# EAGLE design Indev 2 DSP (EAGLE 6.3)
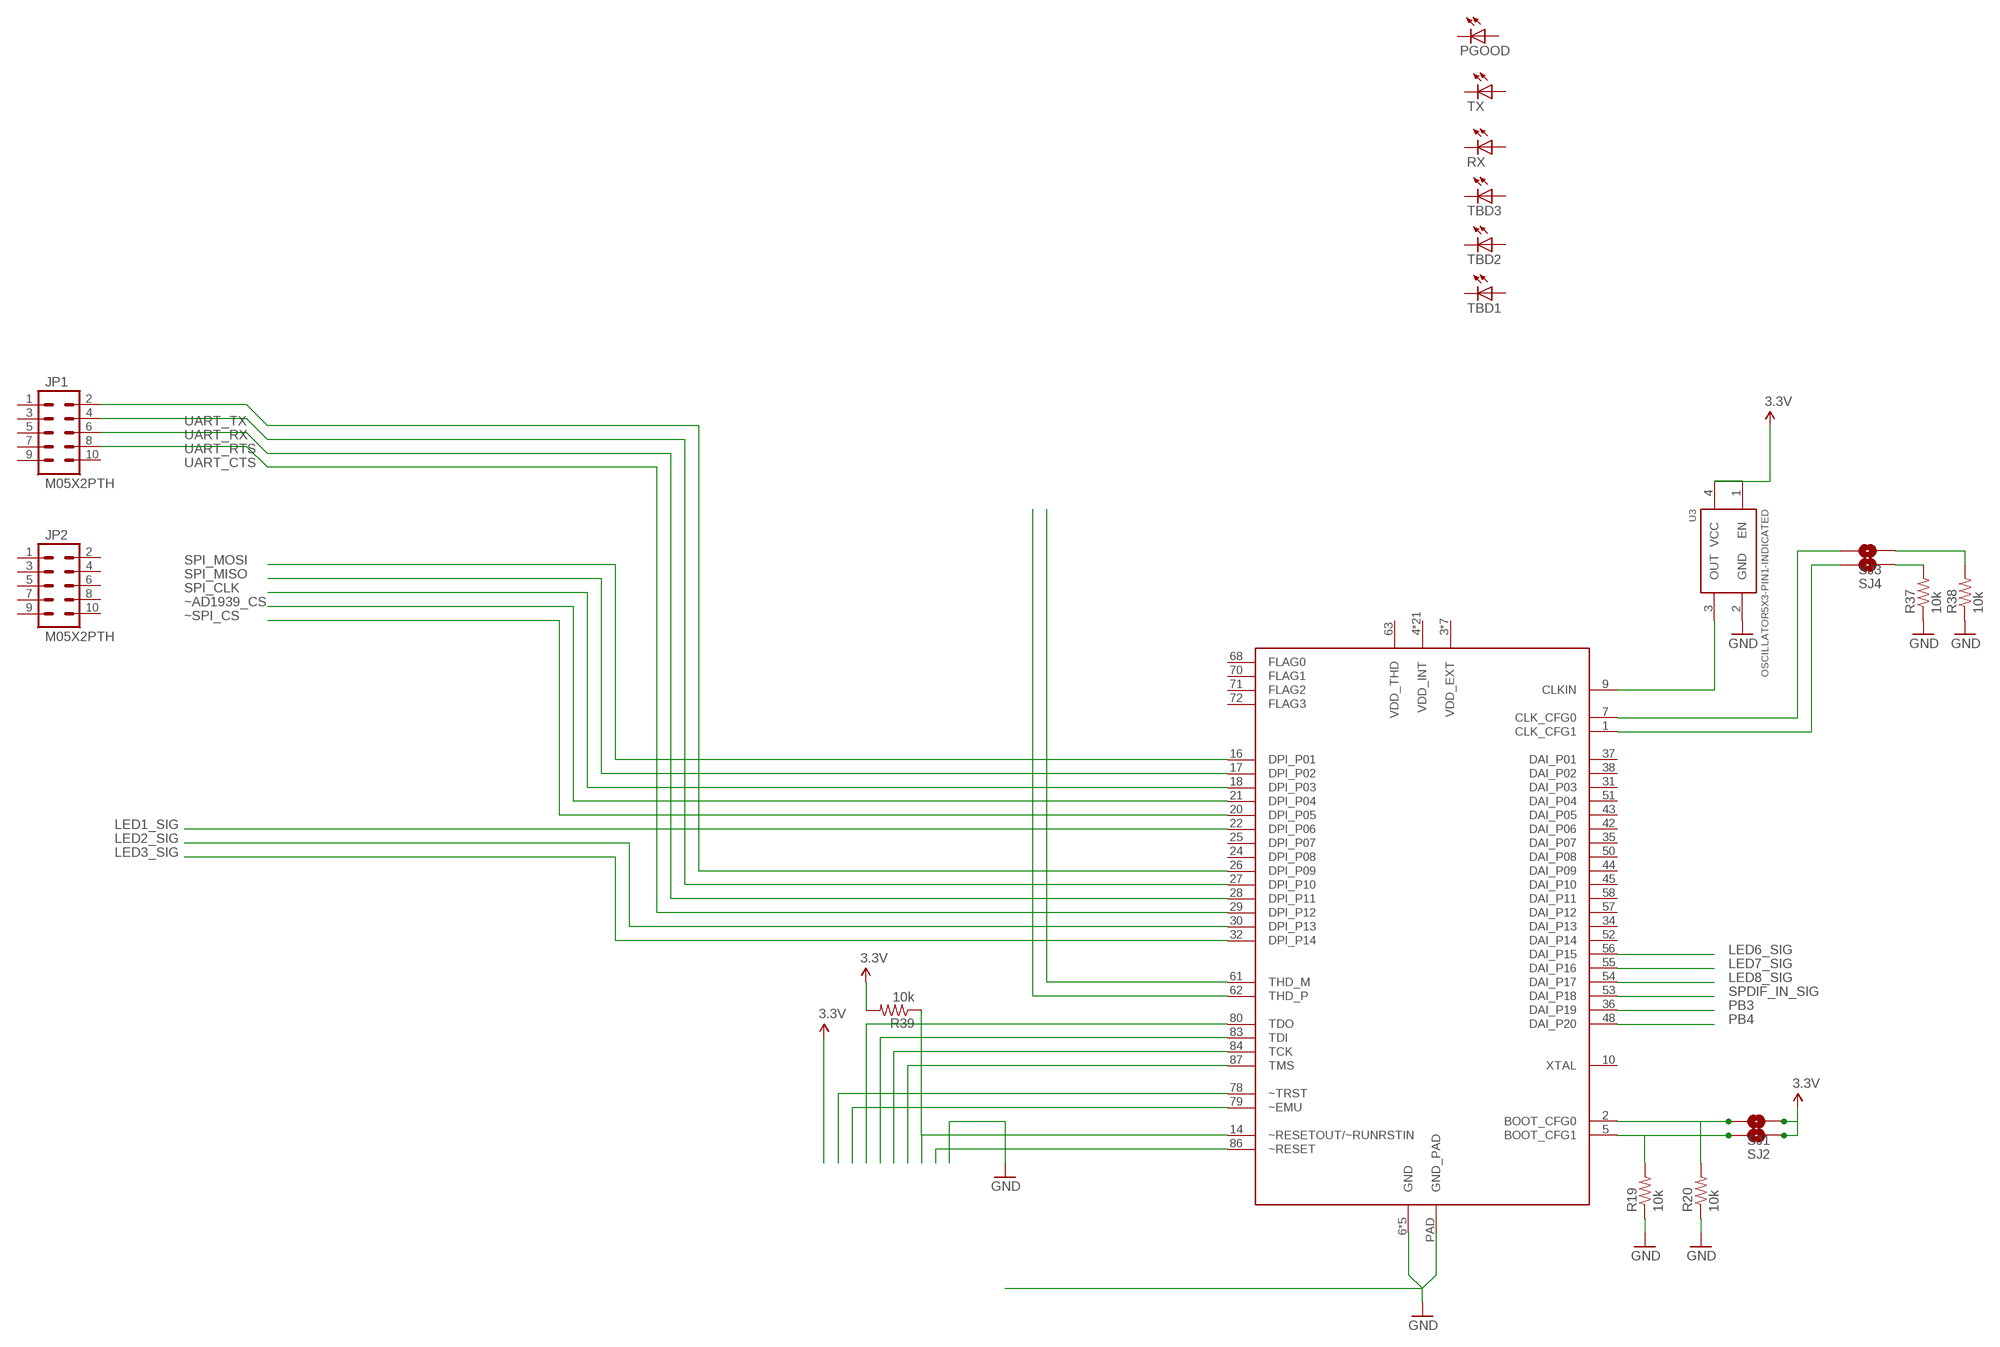
[diagram p0: schematic, sheet 1, part 1 of 2]
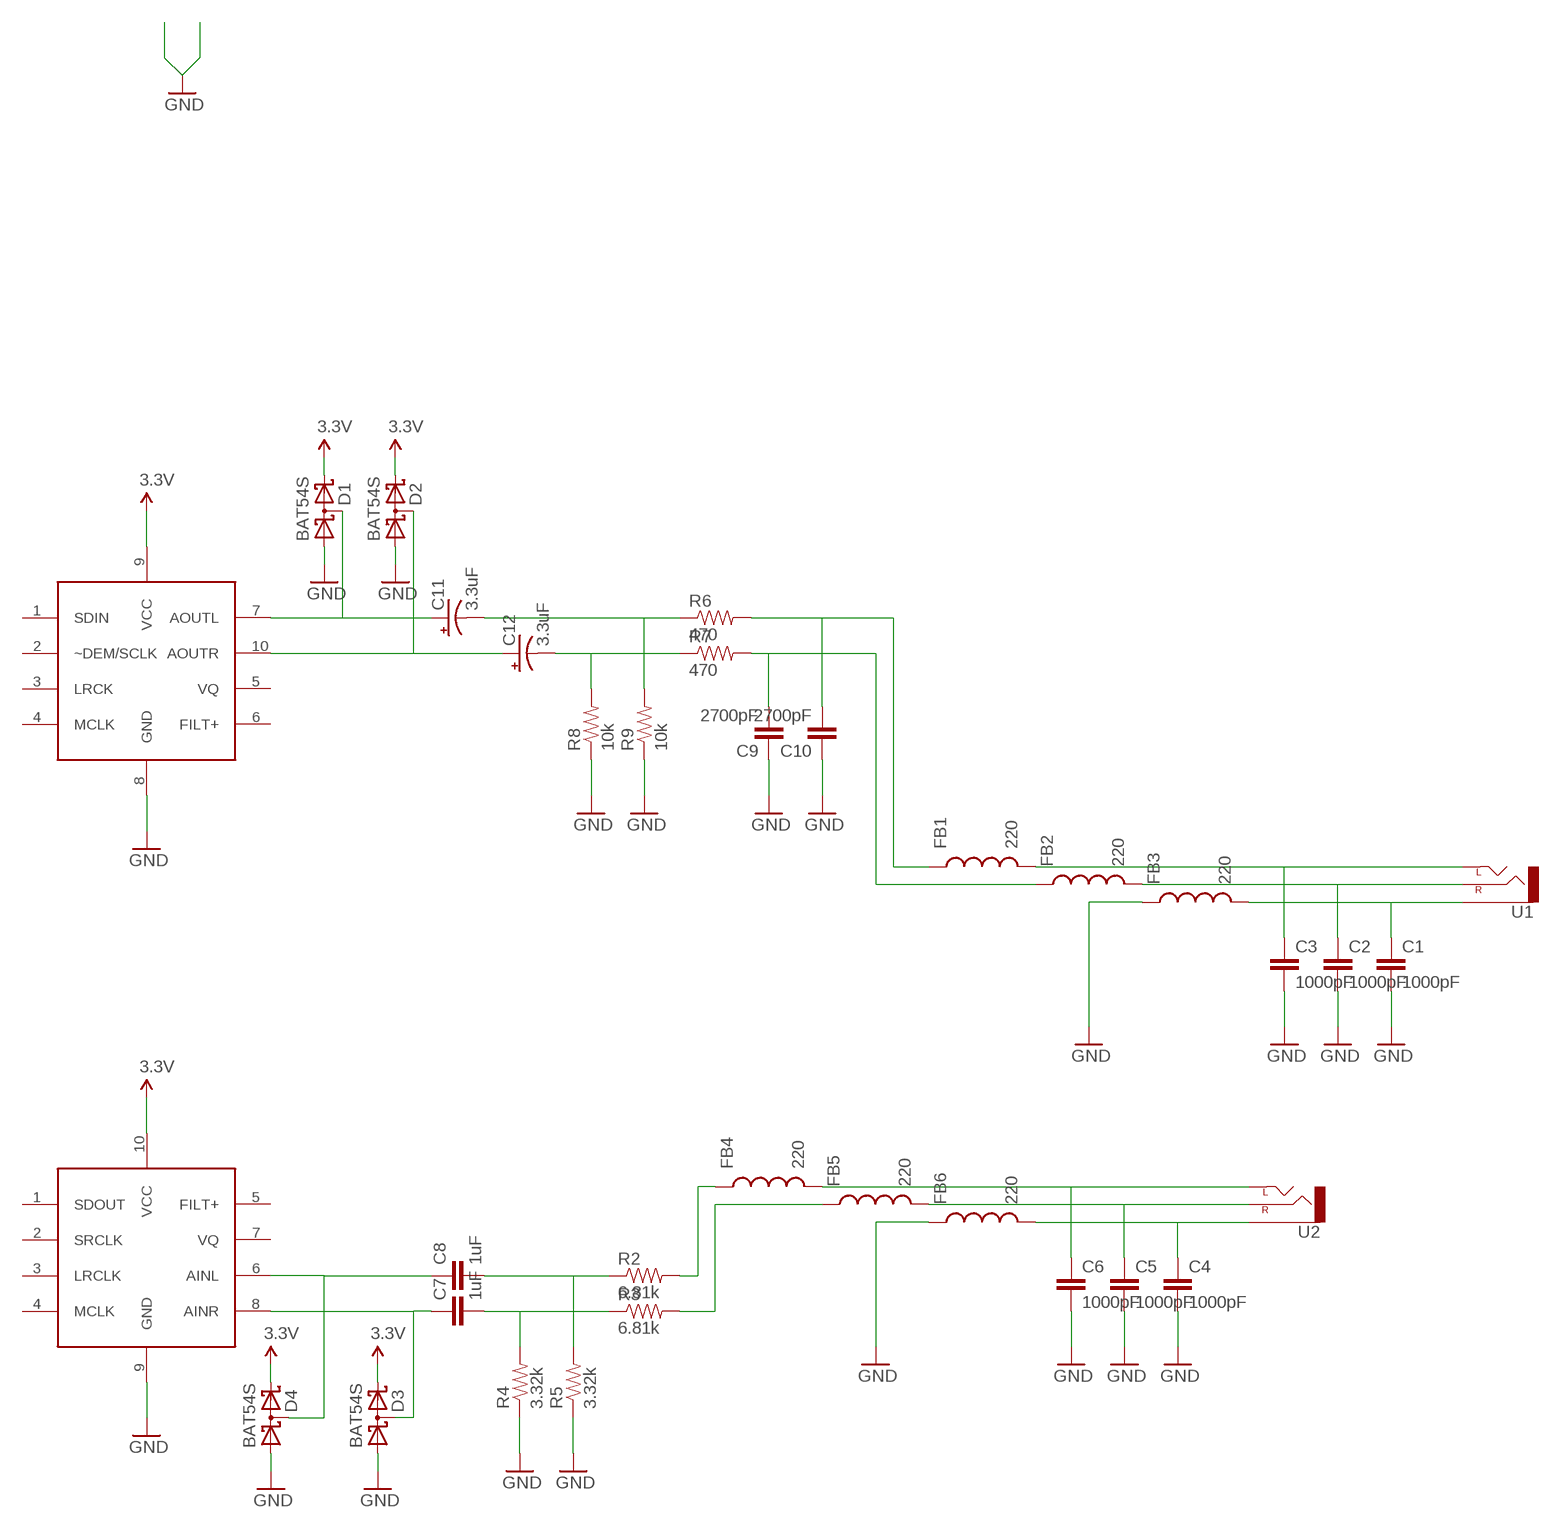
[diagram p1: schematic, sheet 1, part 2 of 2]

## Parts
C1  1000pF  CAP0402-CAP  [0402-CAP]
C2  1000pF  CAP0402-CAP  [0402-CAP]
C3  1000pF  CAP0402-CAP  [0402-CAP]
C4  1000pF  CAP0402-CAP  [0402-CAP]
C5  1000pF  CAP0402-CAP  [0402-CAP]
C6  1000pF  CAP0402-CAP  [0402-CAP]
C7  1uF  CAP0402-CAP  [0402-CAP]
C8  1uF  CAP0402-CAP  [0402-CAP]
C9  2700pF  CAP0402-CAP  [0402-CAP]
C10  2700pF  CAP0402-CAP  [0402-CAP]
C11  3.3uF  CAP_POL1206  [EIA3216]
C12  3.3uF  CAP_POL1206  [EIA3216]
D1  BAT54S  [SOT23]
D2  BAT54S  [SOT23]
D3  BAT54S  [SOT23]
D4  BAT54S  [SOT23]
FB1  220  INDUCTOR0805  [0805]
FB2  220  INDUCTOR0805  [0805]
FB3  220  INDUCTOR0805  [0805]
FB4  220  INDUCTOR0805  [0805]
FB5  220  INDUCTOR0805  [0805]
FB6  220  INDUCTOR0805  [0805]
JP1  M05X2PTH  [AVR_ICSP]
JP2  M05X2PTH  [AVR_ICSP]
PGOOD  LEDCHIP-LED0603  [CHIP-LED0603]
R2  6.81k  RESISTOR0603-RES  [0603-RES]
R3  6.81k  RESISTOR0603-RES  [0603-RES]
R4  3.32k  RESISTOR0603-RES  [0603-RES]
R5  3.32k  RESISTOR0603-RES  [0603-RES]
R6  470  RESISTOR0603-RES  [0603-RES]
R7  470  RESISTOR0603-RES  [0603-RES]
R8  10k  RESISTOR0603-RES  [0603-RES]
R9  10k  RESISTOR0603-RES  [0603-RES]
R19  10k  RESISTOR0603-RES  [0603-RES]
R20  10k  RESISTOR0603-RES  [0603-RES]
R37  10k  RESISTOR0603-RES  [0603-RES]
R38  10k  RESISTOR0603-RES  [0603-RES]
R39  10k  RESISTOR0603-RES  [0603-RES]
RX  LEDCHIP-LED0603  [CHIP-LED0603]
SJ1  SOLDERJUMPERNC  [SJ_2S]
SJ2  SOLDERJUMPERNC  [SJ_2S]
SJ3  SOLDERJUMPERNC  [SJ_2S]
SJ4  SOLDERJUMPERNC  [SJ_2S]
TBD1  LEDCHIP-LED0603  [CHIP-LED0603]
TBD2  LEDCHIP-LED0603  [CHIP-LED0603]
TBD3  LEDCHIP-LED0603  [CHIP-LED0603]
TX  LEDCHIP-LED0603  [CHIP-LED0603]
U1  AUDIO-JACKSMD2  [AUDIO-JACK-3.5MM-SMD]
U2  AUDIO-JACKSMD2  [AUDIO-JACK-3.5MM-SMD]
U3  OSCILLATOR5X3-PIN1-INDICATED  [CRYSTAL-OSC-SMD-5X3]
U$1  ADSP-21479  [QFN-88]
U$2  CS4344-DAC  [TSSOP-10]
U$3  CS5343  [TSSOP-10]

## Nets
3.3V: R39.2 SJ1.1 SJ2.1 U3.1(EN) U3.4(VCC)
AIN_SLEEV: C4.1 FB6.2 U2.SLEEVE
AINL: C6.1 FB4.2 U2.TIP(LEFT)
AINL_C: C8.1 D4.3(C1A2) U$3.6(AINL)
AINL_FB: FB4.1 R2.2
AINL_R: C8.2 R2.1 R5.2
AINR: C5.1 FB5.2 U2.RING(RIGHT)
AINR_C: C7.1 D3.3(C1A2) U$3.8(AINR)
AINR_FB: FB5.1 R3.2
AINR_R: C7.2 R3.1 R4.2
AOUTL: C3.1 FB1.2 U1.TIP(LEFT)
AOUTL_C: C11.A(+) D1.3(C1A2) U$2.7(AOUTL)
AOUTL_FB: C10.2 FB1.1 R6.2
AOUTL_R: C11.C(-) R6.1 R9.2
AOUTR: C2.1 FB2.2 U1.RING(RIGHT)
AOUTR_C: C12.A(+) D2.3(C1A2) U$2.10(AOUTR)
AOUTR_FB: C9.2 FB2.1 R7.2
AOUTR_R: C12.C(-) R7.1 R8.2
AOUTS: C1.1 FB3.2 U1.SLEEVE
GND: C1.2 C2.2 C3.2 C4.2 C5.2 C6.2 C9.1 C10.1 D1.1(A1) D2.1(A1) D3.1(A1) D4.1(A1) FB3.1 FB6.1 R4.1 R5.1 R8.1 R9.1 R19.1 R20.1 R37.1 R38.1 U3.2(GND) U$1.6(GND) U$1.60(GND) U$1.73(GND) U$1.74(GND) U$1.76(GND) U$1.PAD(GND_PAD) U$2.8(GND) U$3.9(GND)
LED1_SIG: U$1.22(DPI_P06)
LED2_SIG: U$1.30(DPI_P13)
LED3_SIG: U$1.32(DPI_P14)
LED6_SIG: U$1.56(DAI_P15)
LED7_SIG: U$1.55(DAI_P16)
LED8_SIG: U$1.54(DAI_P17)
N$1: U$1.78(~TRST)
N$4: U3.3(OUT) U$1.9(CLKIN)
N$7: SJ3.2 U$1.7(CLK_CFG0)
N$8: SJ4.2 U$1.1(CLK_CFG1)
N$9: R37.2 SJ4.1
N$12: R38.2 SJ3.1
N$14: U$1.79(~EMU)
N$15: U$1.80(TDO)
N$18: U$1.83(TDI)
N$19: U$1.84(TCK)
N$20: R20.2 SJ1.2 U$1.2(BOOT_CFG0)
N$21: U$1.87(TMS)
N$25: R39.1 U$1.14(~RESETOUT/~RUNRSTIN)
N$26: U$1.61(THD_M)
N$28: U$1.86(~RESET)
N$37: R19.2 SJ2.2 U$1.5(BOOT_CFG1)
N$38: U$1.62(THD_P)
PB3: U$1.36(DAI_P19)
PB4: U$1.48(DAI_P20)
SPDIF_IN_SIG: U$1.53(DAI_P18)
SPI_CLK: U$1.18(DPI_P03)
SPI_MISO: U$1.17(DPI_P02)
SPI_MOSI: U$1.16(DPI_P01)
UART_CTS: JP1.8 U$1.29(DPI_P12)
UART_RTS: JP1.6 U$1.28(DPI_P11)
UART_RX: JP1.4 U$1.27(DPI_P10)
UART_TX: JP1.2 U$1.26(DPI_P09)
VCC: D1.2(C2) D2.2(C2) D3.2(C2) D4.2(C2) U$2.9(VCC) U$3.10(VCC) ; supply symbol labelled 3.3V
~AD1939_CS: U$1.21(DPI_P04)
~SPI_CS: U$1.20(DPI_P05)
Unconnected: JP1.1 JP1.3 JP1.5 JP1.7 JP1.9 JP1.10 JP2.1 JP2.2 JP2.3 JP2.4 JP2.5 JP2.6 JP2.7 JP2.8 JP2.9 JP2.10 PGOOD.A PGOOD.C RX.A RX.C TBD1.A TBD1.C TBD2.A TBD2.C TBD3.A TBD3.C TX.A TX.C U$1.3(VDD_EXT) U$1.4(VDD_INT) U$1.8(VDD_INT) U$1.10(XTAL) U$1.11(VDD_EXT) U$1.12(VDD_INT) U$1.13(VDD_INT) U$1.15(VDD_INT) U$1.19(VDD_INT) U$1.23(VDD_EXT) U$1.24(DPI_P08) U$1.25(DPI_P07) U$1.31(DAI_P03) U$1.33(VDD_INT) U$1.34(DAI_P13) U$1.35(DAI_P07) U$1.37(DAI_P01) U$1.38(DAI_P02) U$1.39(VDD_INT) U$1.40(VDD_EXT) U$1.41(VDD_INT) U$1.42(DAI_P06) U$1.43(DAI_P05) U$1.44(DAI_P09) U$1.45(DAI_P10) U$1.46(VDD_INT) U$1.47(VDD_EXT) U$1.49(VDD_INT) U$1.50(DAI_P08) U$1.51(DAI_P04) U$1.52(DAI_P14) U$1.57(DAI_P12) U$1.58(DAI_P11) U$1.59(VDD_INT) U$1.63(VDD_THD) U$1.64(VDD_INT) U$1.65(VDD_INT) U$1.66(VDD_INT) U$1.67(VDD_INT) U$1.68(FLAG0) U$1.69(VDD_INT) U$1.70(FLAG1) U$1.71(FLAG2) U$1.72(FLAG3) U$1.75(VDD_EXT) U$1.77(VDD_INT) U$1.81(VDD_EXT) U$1.82(VDD_INT) U$1.85(VDD_INT) U$1.88(VDD_INT) U$2.1(SDIN) U$2.2(~DEM/SCLK) U$2.3(LRCK) U$2.4(MCLK) U$2.5(VQ) U$2.6(FILT+) U$3.1(SDOUT) U$3.2(SRCLK) U$3.3(LRCLK) U$3.4(MCLK) U$3.5(FILT+) U$3.7(VQ)

## Library data of the parts
C1-C10 = 1x05smd:CAP: Capacitor Standard 0603 ceramic capacitor, and 0.1" leaded capacitor.
C11 C12 = 1x05smd:CAP_POL: Capacitor Polarized These are standard SMD and PTH capacitors. Normally 10uF, 47uF, and 100uF in electrolytic and tantalum varieties. Always verify the external diameter of the through hole cap, it varies with capacity, voltage, and manufacturer. The EIA devices should be standard.
D1-D4 = diode:BAT54S: Schottky Diodes Pin connection corrected 2011-05-04 Source: Fairchild .. BAT54.pdf
FB1-FB6 = SparkFun-Passives:INDUCTOR: Inductors Basic Inductor/Choke - 0603 and 1206. Footprints are not proven and vary greatly between part numbers.
JP1 JP2 = SparkFun-Connectors:M05X2: Header 5x2 Standard 10-pin dual row 0.1" header. Commonly used with AVR-ISP. Use with Spark Fun Electronics SKU: PRT-00778
PGOOD RX TBD1-TBD3 TX = adafruit:LED: LED OSRAM: - CHIPLED LG R971, LG N971, LY N971, LG Q971, LY Q971, LO R971, LY R971 LH N974, LH R974 LS Q976, LO Q976, LY Q976 LO Q996 - Hyper CHIPLED LW Q18S LB Q993, LB Q99A, LB R99A - SideLED LS A670, LO A670, LY A670, LG A670, LP A670 LB A673, LV A673, LT A673, LW A673 LH A674 LY A675 LS A676, LA A676, LO A676, LY A676, LW A676 LS A679, LY A679, LG A679 - Hyper Micro SIDELED® LS Y876, LA Y876, LO Y876, LY Y876 LT Y87S - SmartLED LW L88C, LW L88S LB L89C, LB L89S, LG L890 LS L89K, LO L89K, LY L89K LS L896, LA L896, LO L896, LY L896 - TOPLED LS T670, LO T670, LY T670, LG T670, LP T670 LSG T670, LSP T670, LSY T670, LOP T670, LYG T670 LG T671, LOG T671, LSG T671 LB T673, LV T673, LT T673, LW T673 LH T674 LS T676, LA T676, LO T676, LY T676, LB T676, LH T676, LSB T676, LW T676 LB T67C, LV T67C, LT T67C, LS T67K, LO T67K, LY T67K, LW E67C LS E67B, LA E67B, LO E67B, LY E67B, LB E67C, LV E67C, LT E67C LW T67C LS T679, LY T679, LG T679 LS T770, LO T770, LY T770, LG T770, LP T770 LB T773, LV T773, LT T773, LW T773 LH T774 LS E675, LA E675, LY E675, LS T675 LS T776, LA T776, LO T776, LY T776, LB T776 LHGB T686 LT T68C, LB T68C - Hyper Mini TOPLED® LB M676 - Mini TOPLED Santana® LG M470 LS M47K, LO M47K, LY M47K Source: http://www.osram.convergy.de/
R2-R9 R19 R20 R37-R39 = 1x05smd:RESISTOR: Resistor Basic schematic elements and footprints for 0603, 1206, and PTH 1/10th watt (small) resistors.
SJ1-SJ4 = 1x05smd:SOLDERJUMPER: Solder Jumper Standard SMD solder jumper. Used to automate production. Two varients : Normally Open and Normally Closed are the same, but have different paste layers. NC will have a large amount of paste and should jumper during reflow.
U1 U2 = SparkFun-Connectors:AUDIO-JACK: 3.5mm Audio Jack Simple 3.5mm common PCB mount audio jack. SKU: PRT-08032
U3 = SparkFun-FreqCtrl:OSCILLATOR: Generic 5x3 and 7x5 oscillators
U$1 = Strutz Electronic Industries:ADSP-21479
U$2 = Strutz Electronic Industries:CS4344-DAC
U$3 = Strutz Electronic Industries:CS5343

## Board
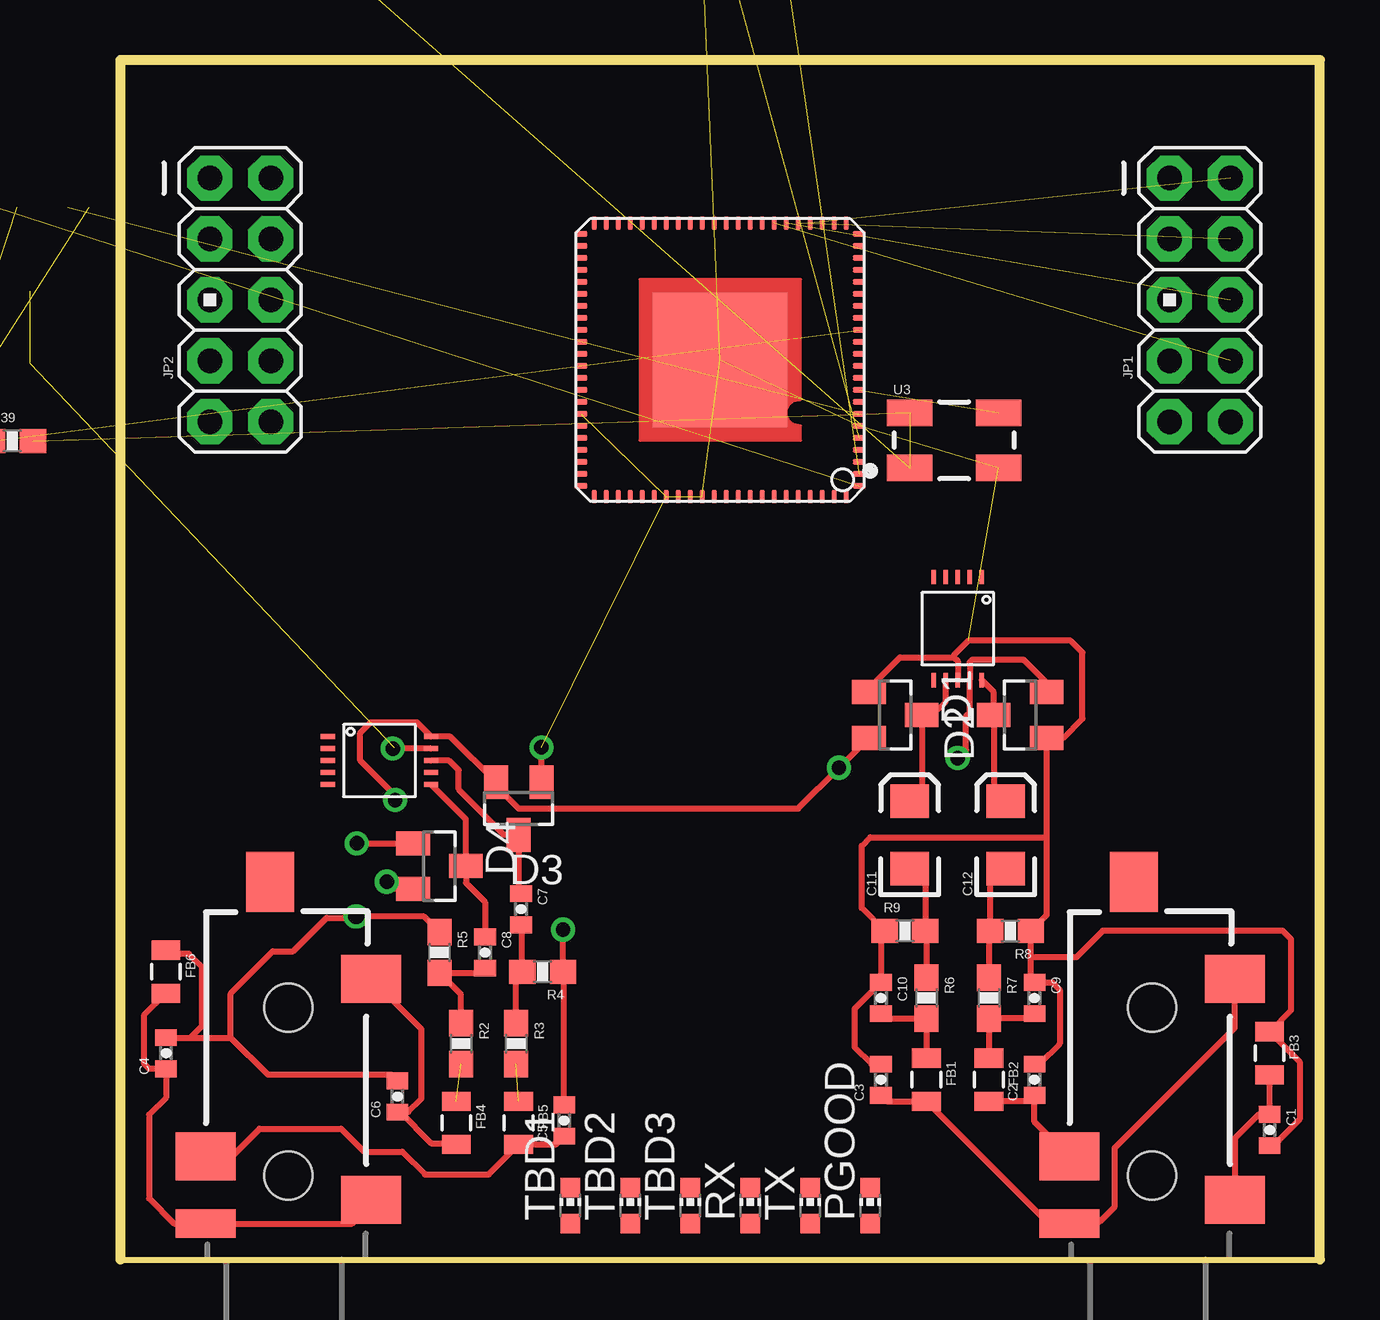
[diagram p2: board, top side]
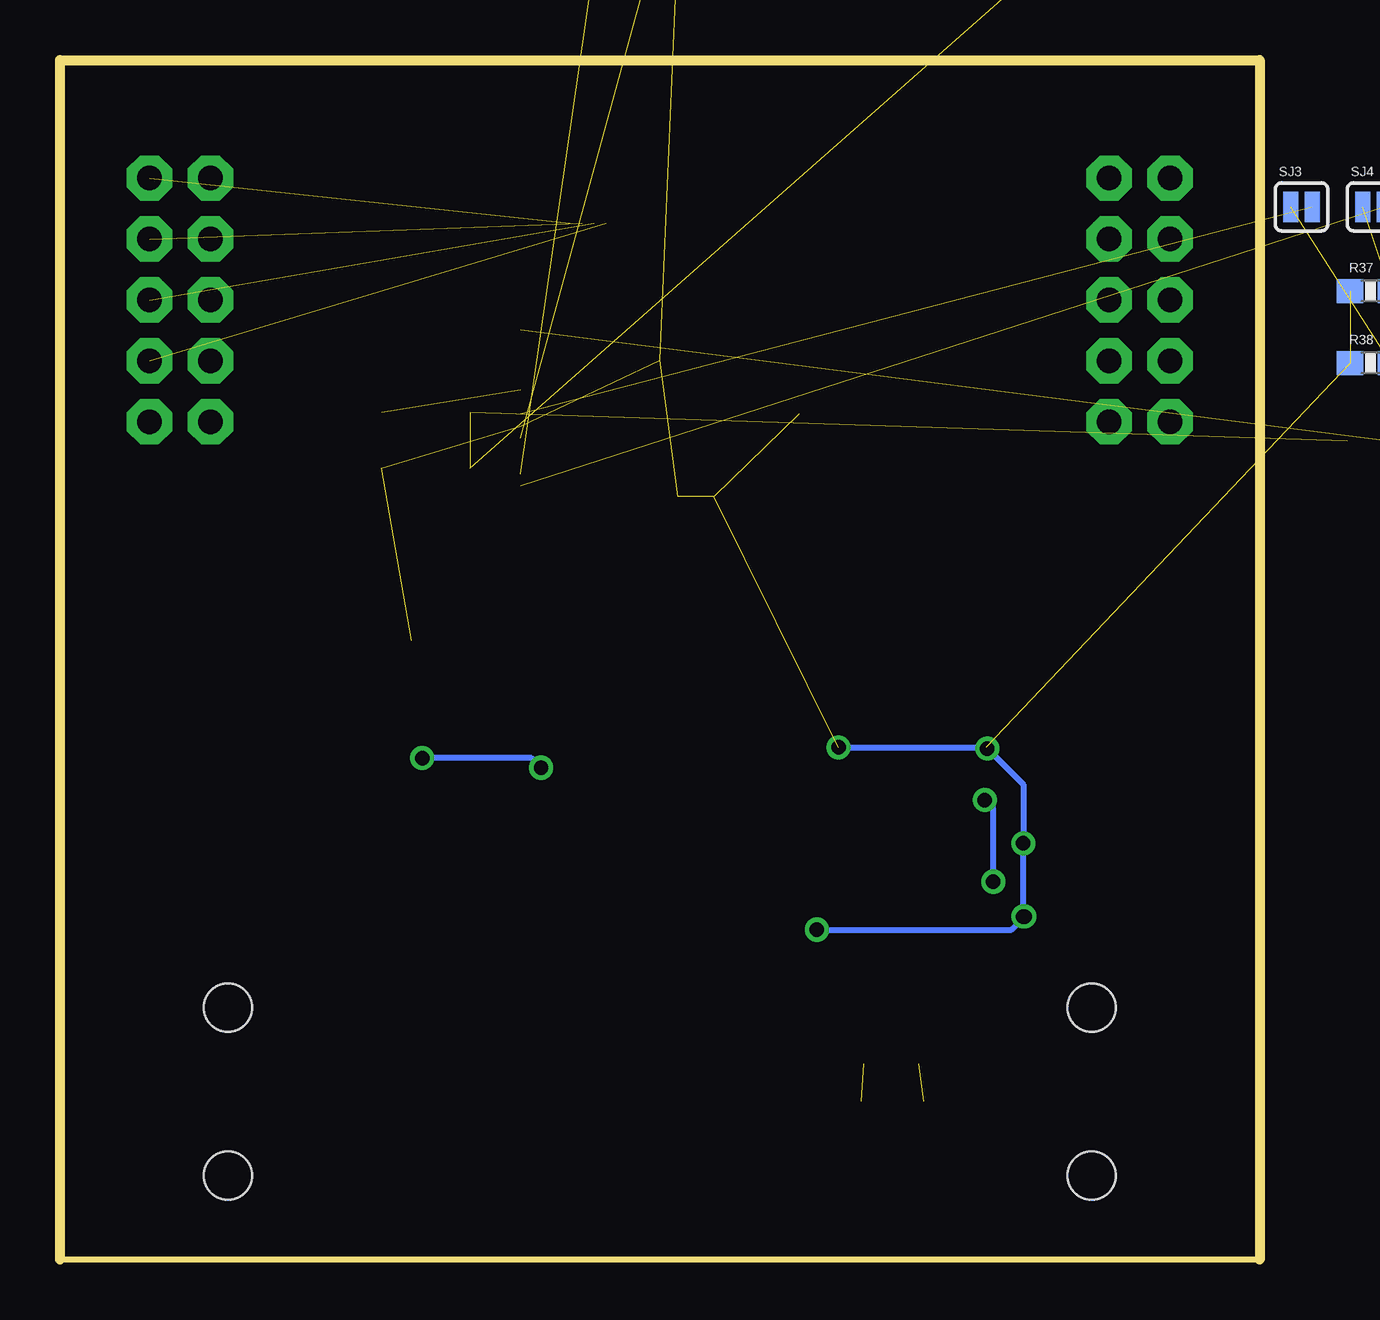
[diagram p3: board, bottom side, seen from below]

Size 50 x 50 mm. Coordinates in mm from the lower left corner, seen from the top.
Outline: 50,50 0,50 0,0 50,0 50,50
Copper layers (1*16): Top 0.035mm / dielectric 0.2mm / Bottom 0.035mm
Design rules "default *": minimum track width 10mil, minimum drill 24mil, track to track 8mil, track to pad 8mil, pad to pad 8mil, via to via 8mil, smd to smd 8mil, copper to edge 40mil, drill to drill 8mil, minimum pad ring 10mil, minimum via ring 8mil, stop-mask expansion 4mil, vias tented up to drill 0mil, thermal gap 10mil

### Footprints (pad centres in the part's own frame; a part is rotated, then mirrored left to right if it is on the bottom)
0402-CAP = smd 0.7 x 0.9: 1 -0.65,0; 2 0.65,0
EIA3216 = smd 1.4 x 1.6: A 1.4,0; C -1.4,0
SOT23 = smd 1 x 1.4: 1 -0.95,-1.1; 2 0.95,-1.1; 3 0,1.1
0805 = smd 0.8 x 1.2: 1 -0.9,0; 2 0.9,0
AVR_ICSP = drill 1.016 pad 1.88 octagon: 1 -1.27,5.08; 2 1.27,5.08; 3 -1.27,2.54; 4 1.27,2.54; 5 -1.27,0; 6 1.27,0; 7 -1.27,-2.54; 8 1.27,-2.54; 9 -1.27,-5.08; 10 1.27,-5.08
CHIP-LED0603 = smd 0.8 x 0.8: A 0,-0.75; C 0,0.75
0603-RES = smd 1.1 x 1: 1 -0.85,0; 2 0.85,0
SJ_2S = smd 0.635 x 1.27: 1 -0.45,0; 2 0.45,0
AUDIO-JACK-3.5MM-SMD = smd 2 x 2.5: RING 4.3,3.45; SLEEVE 2.5,-3.45; TIP 11.7,-3.45 | smd 1.2 x 2.5: RSH 1.5,3.45 | smd 2.5 x 2: TSH 15.75,0.75 | hole 2: 3.5,0; 10.5,0
CRYSTAL-OSC-SMD-5X3 = smd 1.9 x 1.1: 1 -1.85,-1.15; 2 1.85,-1.15; 3 1.85,1.15; 4 -1.85,1.15
QFN-88 = smd 0.55 x 0.23: 1 -5.8,5.25; 2 -5.8,4.75; 3 -5.8,4.25; 4 -5.8,3.75; 5 -5.8,3.25; 6 -5.8,2.75; 7 -5.8,2.25; 8 -5.8,1.75; 9 -5.8,1.25; 10 -5.8,0.75; 11 -5.8,0.25; 12 -5.8,-0.25; 13 -5.8,-0.75; 14 -5.8,-1.25; 15 -5.8,-1.75; 16 -5.8,-2.25; 17 -5.8,-2.75; 18 -5.8,-3.25; 19 -5.8,-3.75; 20 -5.8,-4.25; 21 -5.8,-4.75; 22 -5.8,-5.25; 45 5.8,-5.25; 46 5.8,-4.75; 47 5.8,-4.25; 48 5.8,-3.75; 49 5.8,-3.25; 50 5.8,-2.75; 51 5.8,-2.25; 52 5.8,-1.75; 53 5.8,-1.25; 54 5.8,-0.75; 55 5.8,-0.25; 56 5.8,0.25; 57 5.8,0.75; 58 5.8,1.25; 59 5.8,1.75; 60 5.8,2.25; 61 5.8,2.75; 62 5.8,3.25; 63 5.8,3.75; 64 5.8,4.25; 65 5.8,4.75; 66 5.8,5.25 | smd 0.23 x 0.55: 23 -5.25,-5.7; 24 -4.75,-5.7; 25 -4.25,-5.7; 26 -3.75,-5.7; 27 -3.25,-5.7; 28 -2.75,-5.7; 29 -2.25,-5.7; 30 -1.75,-5.7; 31 -1.25,-5.7; 32 -0.75,-5.7; 33 -0.25,-5.7; 34 0.25,-5.7; 35 0.75,-5.7; 36 1.25,-5.7; 37 1.75,-5.7; 38 2.25,-5.7; 39 2.75,-5.7; 40 3.25,-5.7; 41 3.75,-5.7; 42 4.25,-5.7; 43 4.75,-5.7; 44 5.25,-5.7; 67 5.25,5.7; 68 4.75,5.7; 69 4.25,5.7; 70 3.75,5.7; 71 3.25,5.7; 72 2.75,5.7; 73 2.25,5.7; 74 1.75,5.7; 75 1.25,5.7; 76 0.75,5.7; 77 0.25,5.7; 78 -0.25,5.7; 79 -0.75,5.7; 80 -1.25,5.7; 81 -1.75,5.7; 82 -2.25,5.7; 83 -2.75,5.7; 84 -3.25,5.7; 85 -3.75,5.7; 86 -4.25,5.7; 87 -4.75,5.7; 88 -5.25,5.7 | smd 5.588 x 5.588: PAD 0,0
TSSOP-10 = smd 0.6 x 0.2: 1 -2.15,1; 2 -2.15,0.5; 3 -2.15,0; 4 -2.15,-0.5; 5 -2.15,-1; 6 2.15,-1; 7 2.15,-0.5; 8 2.15,0; 9 2.15,0.5; 10 2.15,1

### Placement (x,y rotation side)
C1  47.9,5.4 270 top
C2  38.1,7.5 90 top
C3  31.7,7.5 90 top
C4  1.9,8.6 90 top
C5  18.5,5.8 90 top
C6  11.55,6.8 90 top
C7  16.7,14.6 270 top
C8  15.2,12.8 270 top
C9  38.1,10.9 270 top
C10  31.7,10.9 270 top
C11  32.9,17.7 90 top
C12  36.9,17.7 90 top
D1  32.3,22.7 270 top
D2  37.5,22.7 90 top
D3  16.6,18.8 180 top
D4  13.3,16.4 270 top
FB1  33.6,7.5 270 top
FB2  36.2,7.5 270 top
FB3  47.9,8.6 270 top
FB4  14,5.7 270 top
FB5  16.6,5.7 270 top
FB6  1.9,12 270 top
JP1  45,40 0 top
JP2  5,40 0 top
PGOOD  31.25,2.25 0 top
R2  14.2,9 270 top
R3  16.5,9 270 top
R4  17.6,12 180 top
R5  13.3,12.8 270 top
R6  33.6,10.9 270 top
R7  36.2,10.9 270 top
R8  37.1,13.7 180 top
R9  32.7,13.7 0 top
R19  24,60 270 top  (outside the outline)
R20  27,60 270 top  (outside the outline)
R37  -4.62,40.38 0 bottom  (outside the outline)
R38  -4.62,37.38 0 bottom  (outside the outline)
R39  -4.5,34.12 0 top  (outside the outline)
RX  26.25,2.25 0 top
SJ1  7.9,54.6 270 top  (outside the outline)
SJ2  13,63 270 top  (outside the outline)
SJ3  -1.75,43.88 0 bottom
SJ4  -4.75,43.88 0 bottom  (outside the outline)
TBD1  18.75,2.25 0 top
TBD2  21.25,2.25 0 top
TBD3  23.75,2.25 0 top
TX  28.75,2.25 0 top
U1  43,0 90 top
U2  7,0 90 top
U3  34.75,34.15 0 top
U$1  25,37.5 180 top
U$2  34.9,26.3 270 top
U$3  10.8,20.8 0 top

### Tracks (layer width: path | path; a pad name or v marks a point on that pad's centre or on a via)
3.3V  (4 unrouted)
AIN_SLEEV
  Top 0.254: U2.SLEEVE 10.75,2.8 10.95,2.8 9.65,1.5 2.25,1.5 1.2,2.55 1.2,6.05 1.9,6.75 C4.1 1.2,7.95 1,8.15 1,10.2 FB6.2
AINL
  Top 0.254: U2.TIP 12.55,9.6 12.55,6.7 12,6.15 C6.1 11.65,6.15 12.95,4.85 13.95,4.85 FB4.2
AINL_C
  Top 0.254: U$3.6 14.4,18.35 D4.3 14.4,15.7 15.2,14.9 C8.1
AINL_FB  (1 unrouted)
AINL_R
  Top 0.254: R2.1 14.2,11.05 R5.2 15,11.95 C8.2
AINR
  Top 0.254: U2.RING 4.65,4.3 5.8,5.45 9.2,5.45 10.15,4.5 11.75,4.5 12.7,3.55 15.35,3.55 FB5.2 18.15,4.8 C5.1
AINR_C
  Top 0.254: C7.1 16.6,15.35 D3.3 16,17.7 14.1,19.6 14.1,20.4 13.7,20.8 U$3.8
AINR_FB  (1 unrouted)
AINR_R
  Top 0.254: R3.1 16.5,11.75 R4.2 16.75,13.9 C7.2
AOUTL
  Top 0.254: C3.1 31.95,6.6 FB1.2 38.6,1.6 40.85,1.6 41.45,2.2 41.45,4.65 46.45,9.65 U1.TIP
AOUTL_C
  Top 0.254: U$2.7 34.4,23.25 33.85,22.7 D1.3 33.4,19.6 C11.A
AOUTL_FB
  Top 0.254: C10.2 31.9,10.05 R6.2 FB1.1
AOUTL_R
  Top 0.254: C11.C 33.55,15.65 R9.2 33.6,13.65 R6.1
AOUTR
  Top 0.254: U1.RING 38.1,5.75 C2.1 37.85,6.6 FB2.2
AOUTR_C
  Top 0.254: C12.A 36.4,19.6 D2.3 36.4,23.65 U$2.10
AOUTR_FB
  Top 0.254: C9.2 37.9,10.05 R7.2 FB2.1
AOUTR_R
  Top 0.254: C12.C 36.25,15.65 R8.2 36.2,13.65 R7.1
AOUTS
  Top 0.254: FB3.2 C1.1 47.45,6.05 46.45,5.05 U1.SLEEVE
GND  (via drill 0.6)  (12 unrouted)
  Top 0.254: FB6.1 2.05,12.75 2.85,12.75 3.4,12.2 3.4,9.75 2.9,9.25 C4.2 4.6,9.25 | C6.2 11.3,7.7 6.15,7.7 4.6,9.25 | C5.2 18.5,11.95 R4.1 v18.45,13.75 | R5.1 12.65,14.3 v9.85,14.3 v9.8,14.3 9.75,14.25 8.6,14.25 7.2,12.85 6.35,12.85 4.6,11.1 4.6,9.25 | v9.85,17.35 D4.1 | U$3.9 v11.35,21.3 | D3.1 v17.55,21.35 | D1.1 31.2,23.8 32.5,25.1 34.75,25.1 | 34.75,25.1 34.9,24.95 U$2.8 | 38.6,17.6 D2.1 39.3,21.75 40.1,22.55 40.1,25.3 39.6,25.8 35.35,25.8 34.75,25.2 34.75,25.1 | 38.6,17.6 38.6,14.35 R8.1 37.95,12.6 | 37.95,12.6 37.95,11.7 C9.1 38.85,11.55 39.15,11.25 39.15,9 38.3,8.15 C2.2 | C3.2 31.3,8.15 30.6,8.85 30.6,10.45 C10.1 31.7,13.55 R9.1 30.9,14.65 30.9,17.25 31.25,17.6 38.6,17.6 | C1.2 48.05,4.75 49.15,5.85 49.15,8.25 FB3.1 48.8,10.4 48.8,13.35 48.45,13.7 40.95,13.7 39.85,12.6 37.95,12.6
  Bottom 0.254: v18.45,13.75 10.35,13.75 v9.8,14.3 | v9.85,14.3 v9.85,17.35 9.85,19.8 v11.35,21.3 11.4,21.35 v17.55,21.35
N$4  (1 unrouted)
N$7  (1 unrouted)
N$8  (1 unrouted)
N$9  (1 unrouted)
N$12  (1 unrouted)
N$20  (2 unrouted)
N$25  (1 unrouted)
N$37  (2 unrouted)
UART_CTS  (1 unrouted)
UART_RTS  (1 unrouted)
UART_RX  (1 unrouted)
UART_TX  (1 unrouted)
VCC  (via drill 0.6)
  Top 0.254: D4.2 11.4,15.45 v11.1,15.75 | v11.45,19.15 11.45,19.35 10,20.8 10,21.95 10.45,22.4 12.35,22.4 U$3.10 13.75,21.8 D3.2 15.65,19.75 16.6,18.8 28.25,18.8 v29.95,20.5 D1.2 | D2.2 38.6,24.05 37.65,25 35.5,25 35.4,24.9 U$2.9 35.4,22.8 35.25,22.65 35.25,21.25 v34.9,20.9
  Bottom 0.254: v11.1,15.75 11.1,18.8 v11.45,19.15 | v29.95,20.5 30.35,20.9 v34.9,20.9